# EasyEDA Pro project ProPrj_nrfSlime_2025-01-05.epro

# Schematic Schematic9
Board Name: nrfSlime v1.0; Create Date: 2024-12-22; Page Name: P1; Project Name: SlimeVR-Module; Schematic Name: Schematic9; Update Date: 2024-12-22; Company: 嘉立创EDA; Page Size: A4; Version: V1.0
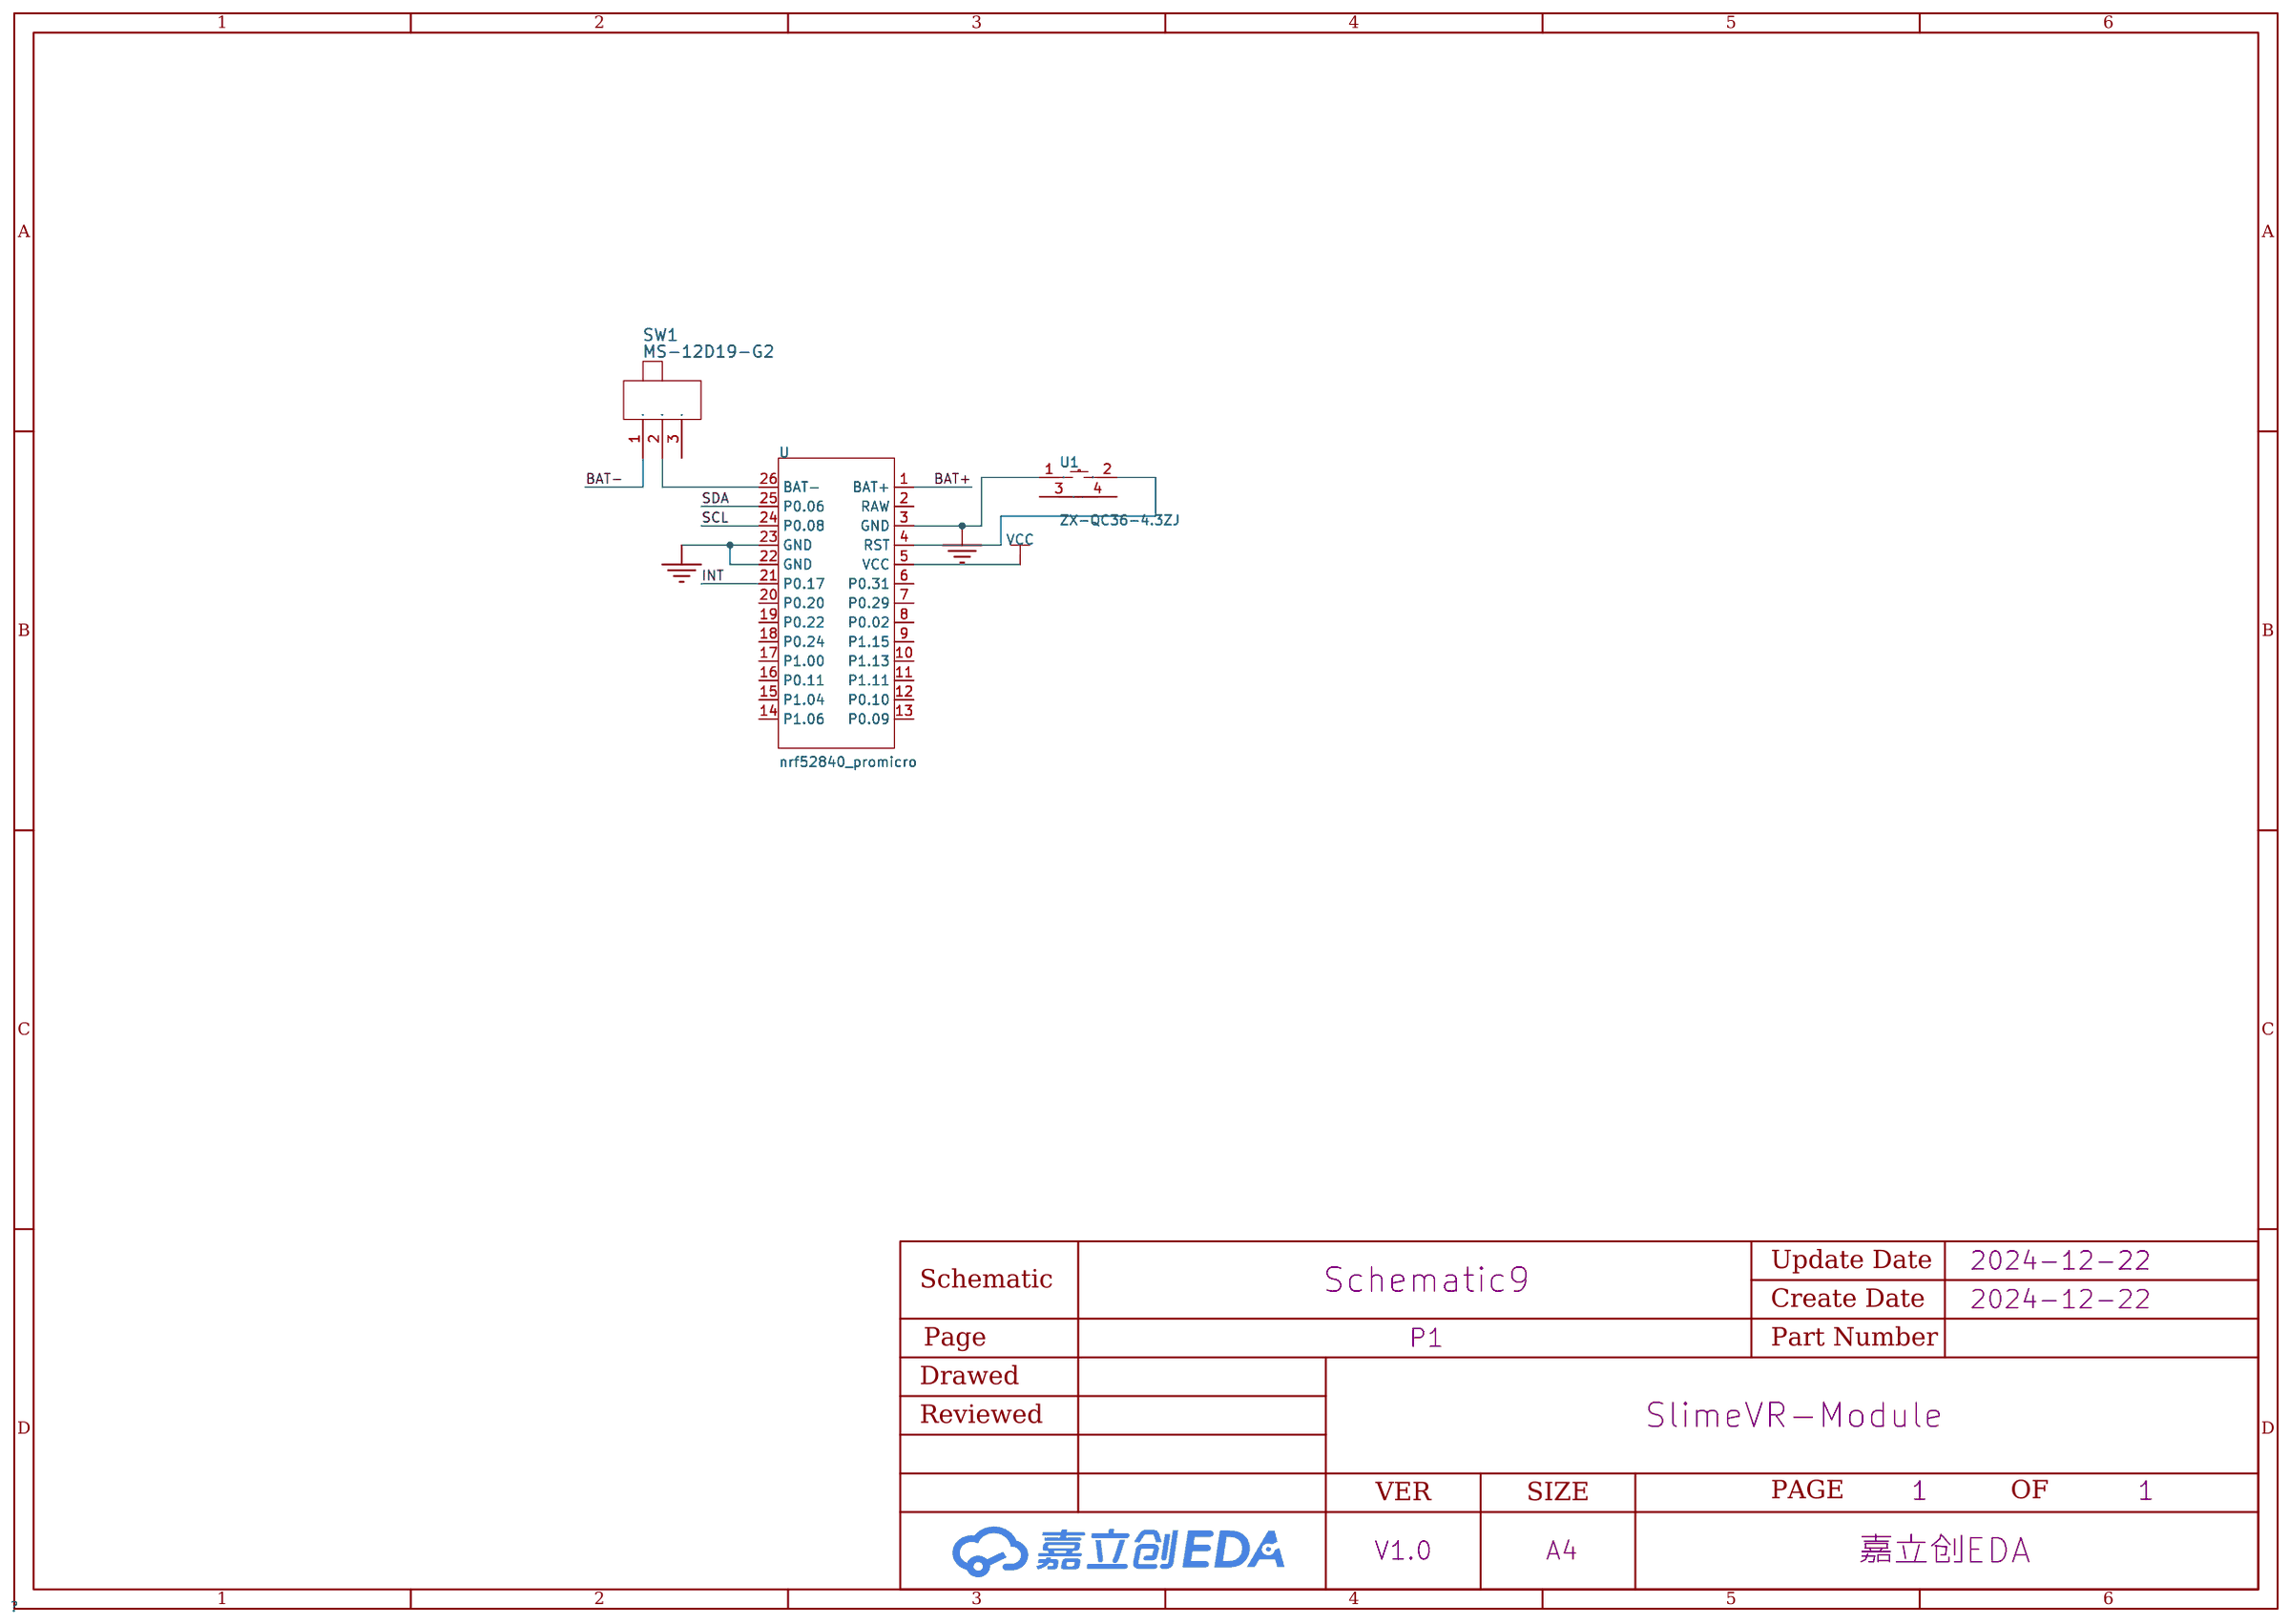
[diagram p0: schematic sheet]

## Parts
SW1  MS-12D19-G2  [12d19g开关]
U  promicro  [nrf_promicro]
U1  ZX-QC36-4.3ZJ  [SW-TH_4P-L7.5-W4.3-P5.00]

## Library data of the parts
SW1 = MS-12D19-G2: Supplier: LCSC; Supplier Part: C2904913; Manufacturer: DEALON(德艺隆)
U = nrf52840_promicro
U1 = ZX-QC36-4.3ZJ: 电路结构:单刀单掷;按钮形状:矩形按钮;作用力:260gf;安装方式:直插;开关长度:3mm;开关宽度:6mm;开关高度:4.3mm;带支架:带支架;触点电流:50mA;额定电压(AC):250V;额定电压(DC):12V;绝缘电阻:100MΩ;机械寿命:10万次;; LCSC Part Name: 3*6*4.3支架开关; Supplier Part: C7470225; Manufacturer: Megastar(兆星); Supplier Footprint: DIP; JLCPCB Part Class: Extended Part; Datasheet: https://atta.szlcsc.com/upload/public/pdf/source/20230724/E16DC04D9D1914154B8FE6FC4973841D.pdf; Supplier: LCSC; Circuit: 单刀单掷; Actuator Style: 矩形按钮; Operating Force: 260gf; Mounting Style: 直插; Switch Length: 3mm; Switch Width: 6mm; Switch Height: 4.3mm; Strike Gundam: 带支架; Contact Current: 50mA; Voltage Rating (AC): 250V; Voltage Rating (DC): 12V; Insulation Resistance: 100MΩ; Actuator/Cap Color: 白色; Pin Style: PC引脚; Mechanical Life: 10万次; Operating Temperature: -30℃~+80℃

## Nets
GND: U.3(GND) U.22(GND) U.23(GND) U1.1
VCC: U.5(VCC)
BAT+: U.1(BAT+)
BAT-: SW1.1
INT: U.21(P0.17)
SCL: U.24(P0.08)
SDA: U.25(P0.06)
$1N588: SW1.2 U.26(BAT-)
Net-(U-4): U.4(RST) U1.2

Not connected (* = marked no-connect by the designer): SW1 3; U 2(RAW) 6(P0.31) 7(P0.29) 8(P0.02) 9(P1.15) 10(P1.13) 11(P1.11) 12(P0.10) 13(P0.09) 14(P1.06) 15(P1.04) 16(P0.11) 17(P1.00) 18(P0.24) 19(P0.22) 20(P0.20); U1 3 4

# Schematic Schematic9_1
Board Name: nrfSlime v1.0; Create Date: 2024-12-22; Page Name: P1; Project Name: SlimeVR-Module; Schematic Name: Schematic9; Update Date: 2024-12-22; Company: 嘉立创EDA; Page Size: A4; Version: V1.0
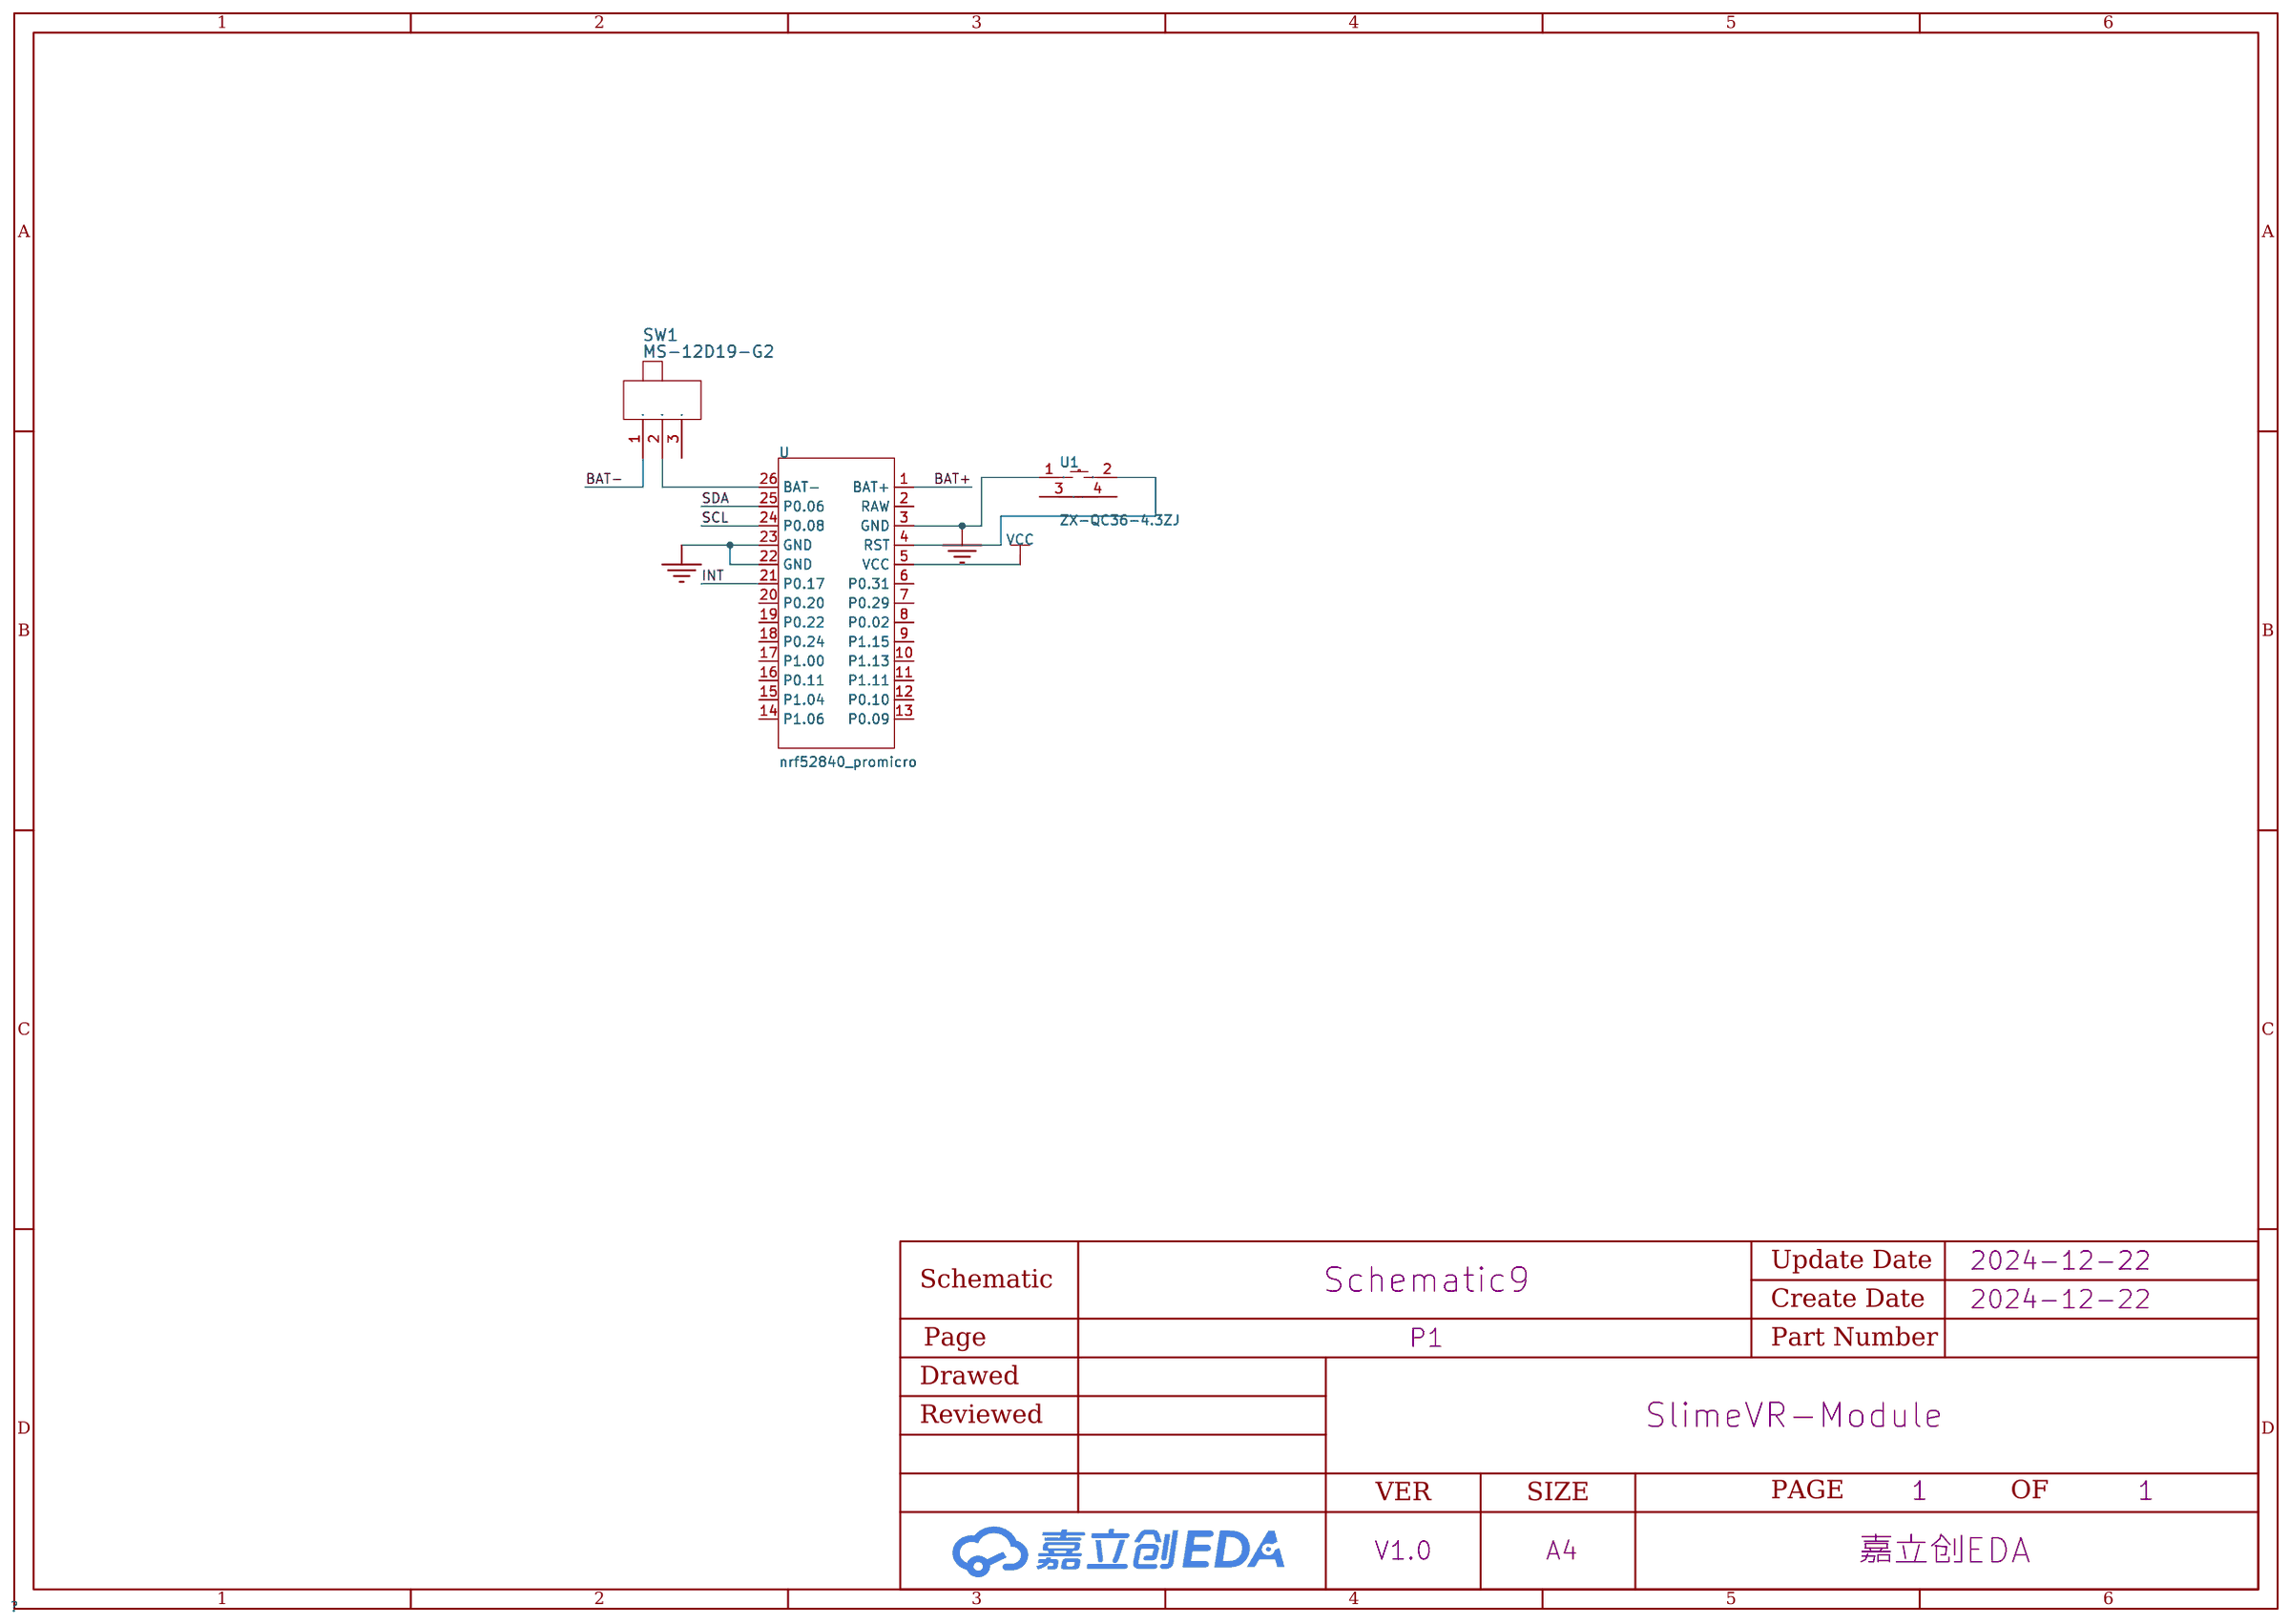
[diagram p1: schematic sheet]

## Parts
SW1  MS-12D19-G2  [12d19g开关]
U  promicro  [nrf_promicro]
U1  ZX-QC36-4.3ZJ  [SW-TH_4P-L7.5-W4.3-P5.00]

## Library data of the parts
SW1 = MS-12D19-G2: Supplier: LCSC; Supplier Part: C2904913; Manufacturer: DEALON(德艺隆)
U = nrf52840_promicro
U1 = ZX-QC36-4.3ZJ: 电路结构:单刀单掷;按钮形状:矩形按钮;作用力:260gf;安装方式:直插;开关长度:3mm;开关宽度:6mm;开关高度:4.3mm;带支架:带支架;触点电流:50mA;额定电压(AC):250V;额定电压(DC):12V;绝缘电阻:100MΩ;机械寿命:10万次;; LCSC Part Name: 3*6*4.3支架开关; Supplier Part: C7470225; Manufacturer: Megastar(兆星); Supplier Footprint: DIP; JLCPCB Part Class: Extended Part; Datasheet: https://atta.szlcsc.com/upload/public/pdf/source/20230724/E16DC04D9D1914154B8FE6FC4973841D.pdf; Supplier: LCSC; Circuit: 单刀单掷; Actuator Style: 矩形按钮; Operating Force: 260gf; Mounting Style: 直插; Switch Length: 3mm; Switch Width: 6mm; Switch Height: 4.3mm; Strike Gundam: 带支架; Contact Current: 50mA; Voltage Rating (AC): 250V; Voltage Rating (DC): 12V; Insulation Resistance: 100MΩ; Actuator/Cap Color: 白色; Pin Style: PC引脚; Mechanical Life: 10万次; Operating Temperature: -30℃~+80℃

## Nets
GND: U.3(GND) U.22(GND) U.23(GND) U1.1
VCC: U.5(VCC)
BAT+: U.1(BAT+)
BAT-: SW1.1
INT: U.21(P0.17)
SCL: U.24(P0.08)
SDA: U.25(P0.06)
$1N588: SW1.2 U.26(BAT-)
Net-(U-4): U.4(RST) U1.2

Not connected (* = marked no-connect by the designer): SW1 3; U 2(RAW) 6(P0.31) 7(P0.29) 8(P0.02) 9(P1.15) 10(P1.13) 11(P1.11) 12(P0.10) 13(P0.09) 14(P1.06) 15(P1.04) 16(P0.11) 17(P1.00) 18(P0.24) 19(P0.22) 20(P0.20); U1 3 4

# Schematic Schematic9_2
Board Name: nrfSlime v1.0; Create Date: 2024-12-22; Page Name: P1; Project Name: SlimeVR-Module; Schematic Name: Schematic9; Update Date: 2024-12-22; Company: 嘉立创EDA; Page Size: A4; Version: V1.0
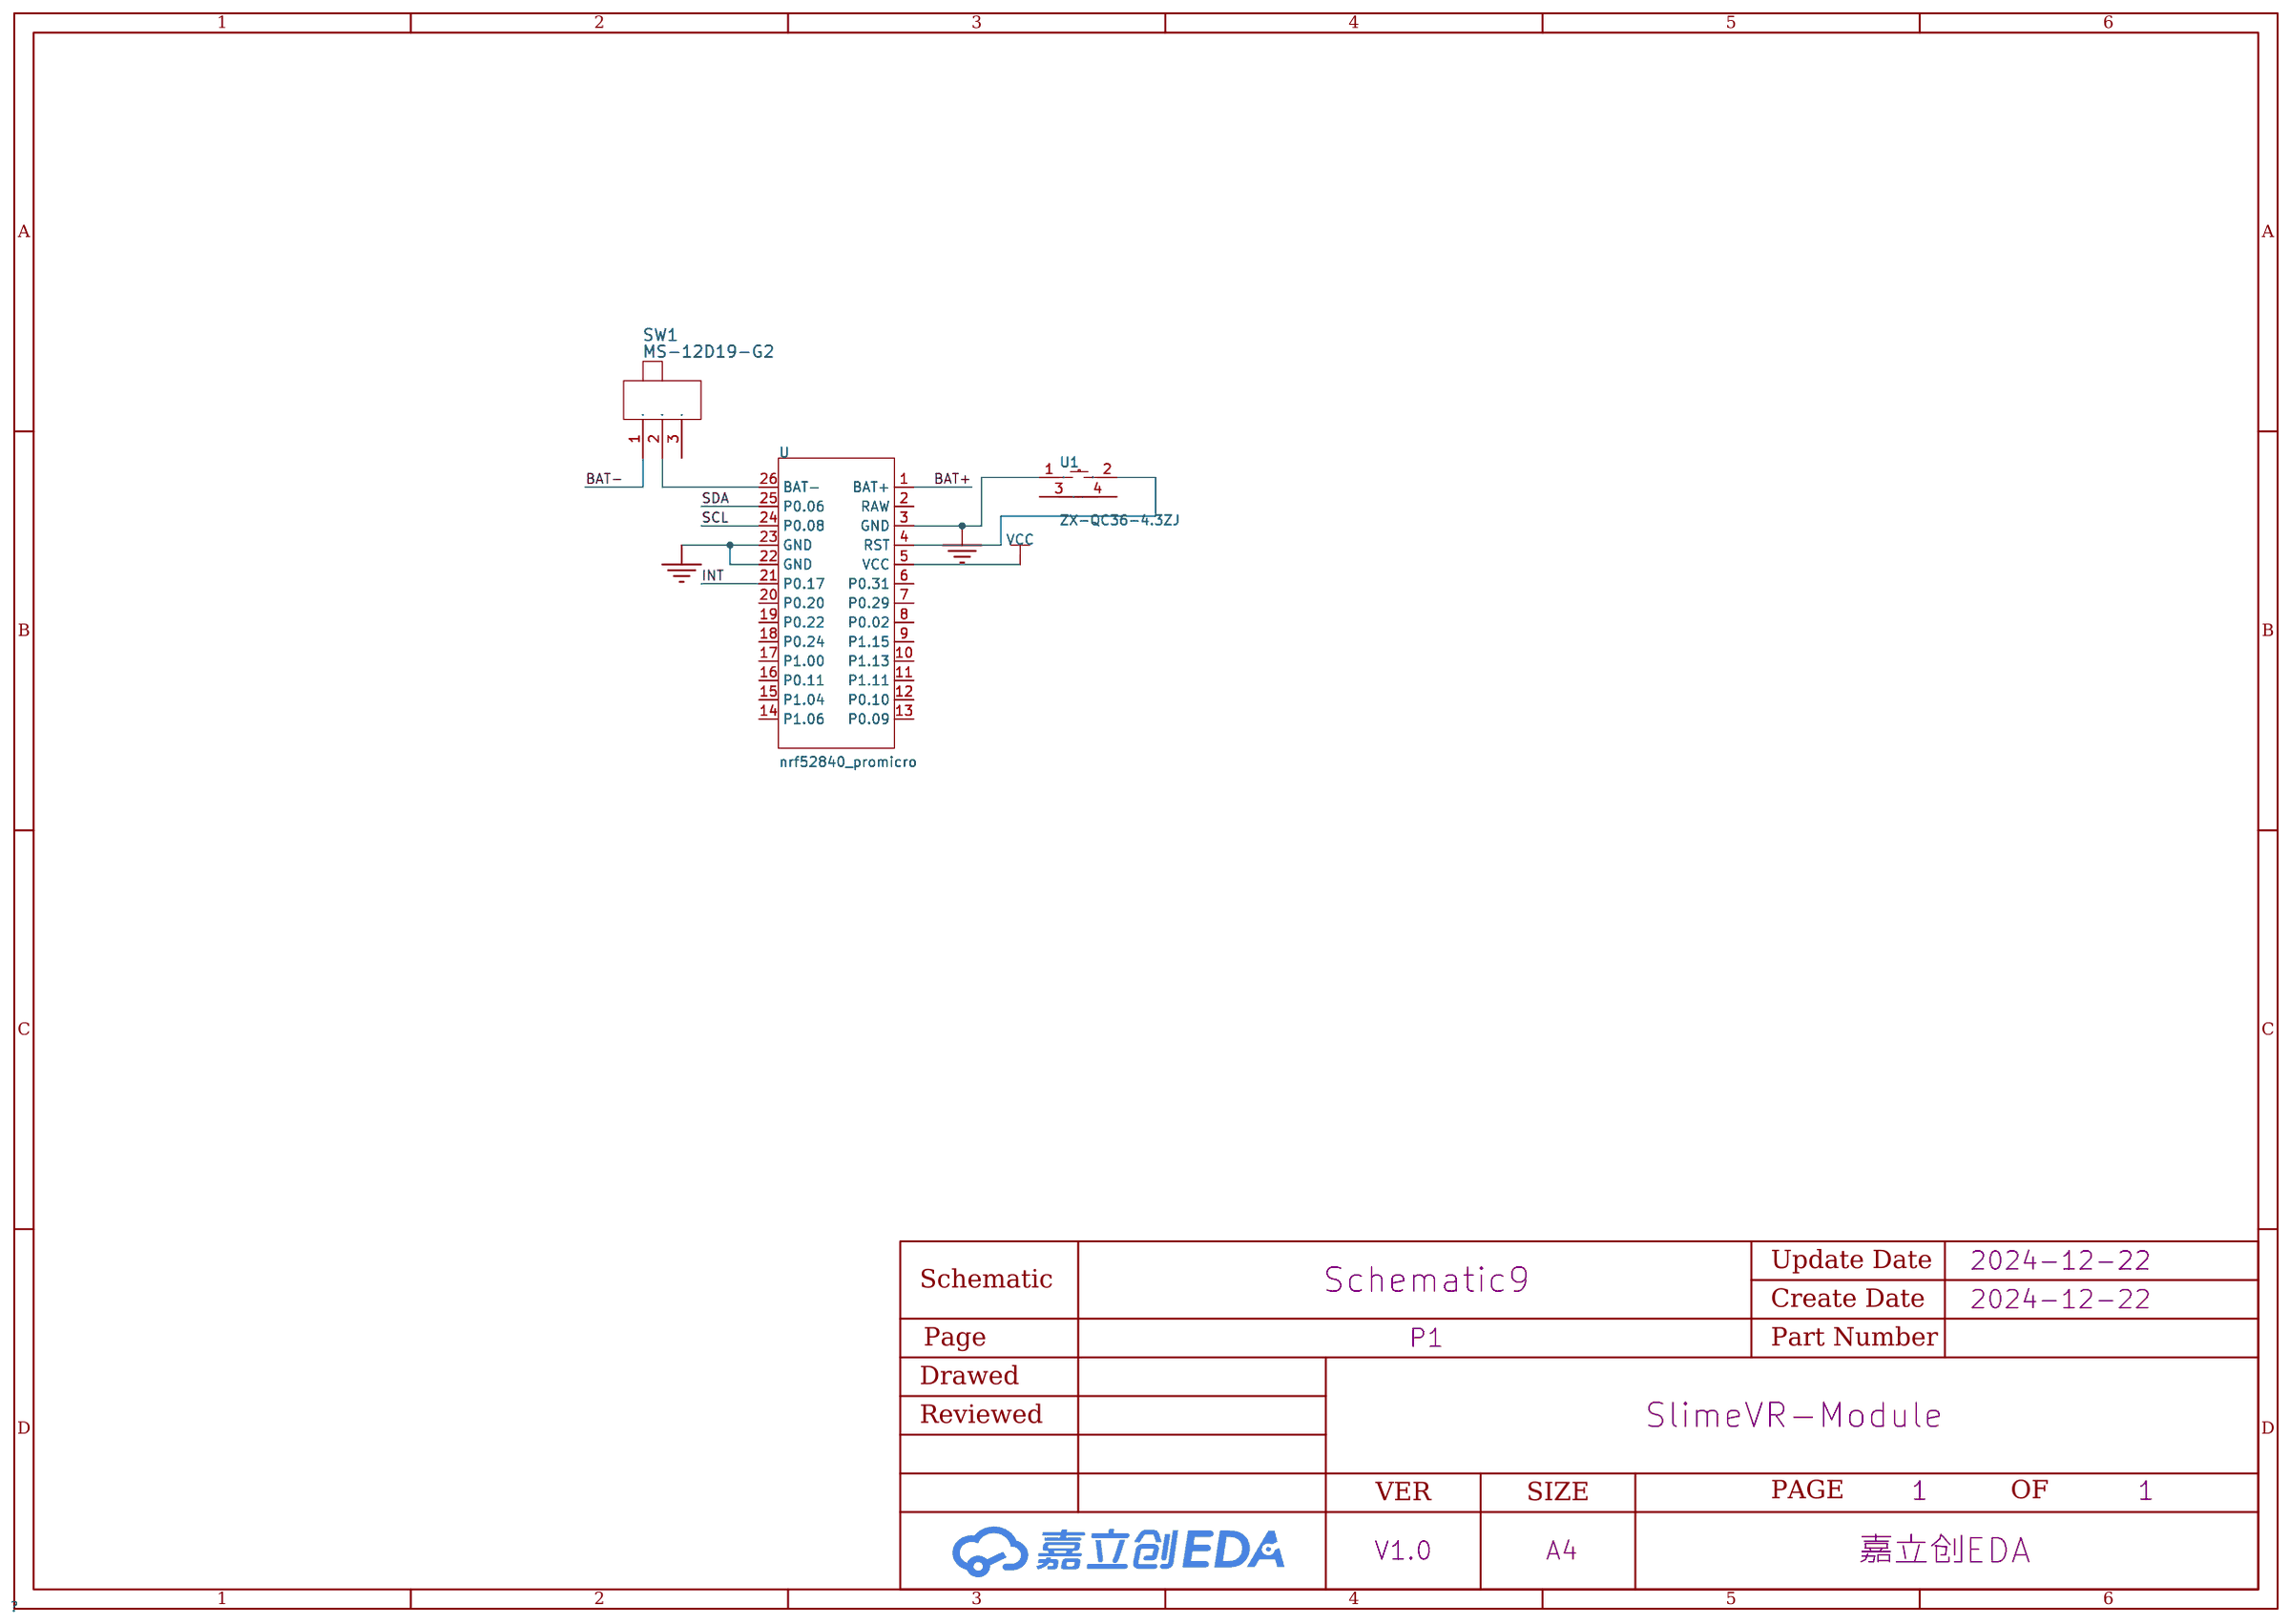
[diagram p2: schematic sheet]

## Parts
SW1  MS-12D19-G2  [12d19g开关]
U  promicro  [nrf_promicro]
U1  ZX-QC36-4.3ZJ  [SW-TH_4P-L7.5-W4.3-P5.00]

## Library data of the parts
SW1 = MS-12D19-G2: Supplier: LCSC; Supplier Part: C2904913; Manufacturer: DEALON(德艺隆)
U = nrf52840_promicro
U1 = ZX-QC36-4.3ZJ: 电路结构:单刀单掷;按钮形状:矩形按钮;作用力:260gf;安装方式:直插;开关长度:3mm;开关宽度:6mm;开关高度:4.3mm;带支架:带支架;触点电流:50mA;额定电压(AC):250V;额定电压(DC):12V;绝缘电阻:100MΩ;机械寿命:10万次;; LCSC Part Name: 3*6*4.3支架开关; Supplier Part: C7470225; Manufacturer: Megastar(兆星); Supplier Footprint: DIP; JLCPCB Part Class: Extended Part; Datasheet: https://atta.szlcsc.com/upload/public/pdf/source/20230724/E16DC04D9D1914154B8FE6FC4973841D.pdf; Supplier: LCSC; Circuit: 单刀单掷; Actuator Style: 矩形按钮; Operating Force: 260gf; Mounting Style: 直插; Switch Length: 3mm; Switch Width: 6mm; Switch Height: 4.3mm; Strike Gundam: 带支架; Contact Current: 50mA; Voltage Rating (AC): 250V; Voltage Rating (DC): 12V; Insulation Resistance: 100MΩ; Actuator/Cap Color: 白色; Pin Style: PC引脚; Mechanical Life: 10万次; Operating Temperature: -30℃~+80℃

## Nets
GND: U.3(GND) U.22(GND) U.23(GND) U1.1
VCC: U.5(VCC)
BAT+: U.1(BAT+)
BAT-: SW1.1
INT: U.21(P0.17)
SCL: U.24(P0.08)
SDA: U.25(P0.06)
$1N588: SW1.2 U.26(BAT-)
Net-(U-4): U.4(RST) U1.2

Not connected (* = marked no-connect by the designer): SW1 3; U 2(RAW) 6(P0.31) 7(P0.29) 8(P0.02) 9(P1.15) 10(P1.13) 11(P1.11) 12(P0.10) 13(P0.09) 14(P1.06) 15(P1.04) 16(P0.11) 17(P1.00) 18(P0.24) 19(P0.22) 20(P0.20); U1 3 4

# Board nrfSlime v1.1_KOUNO'S_ICM45
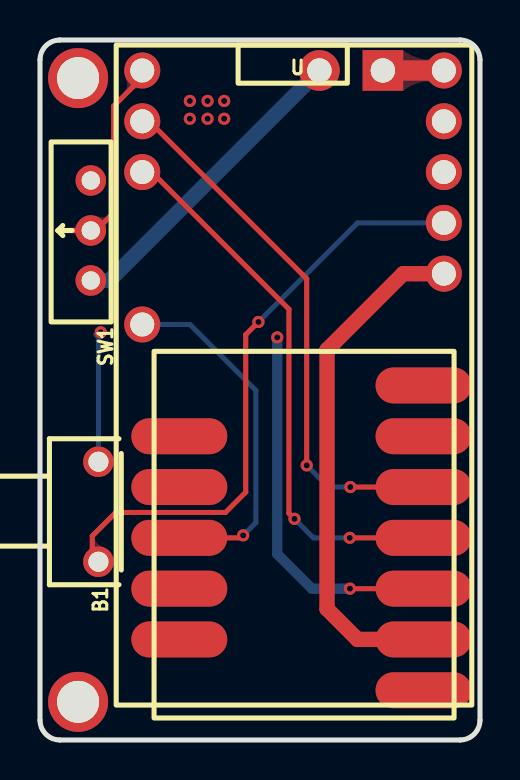
[diagram p3: board, top side]
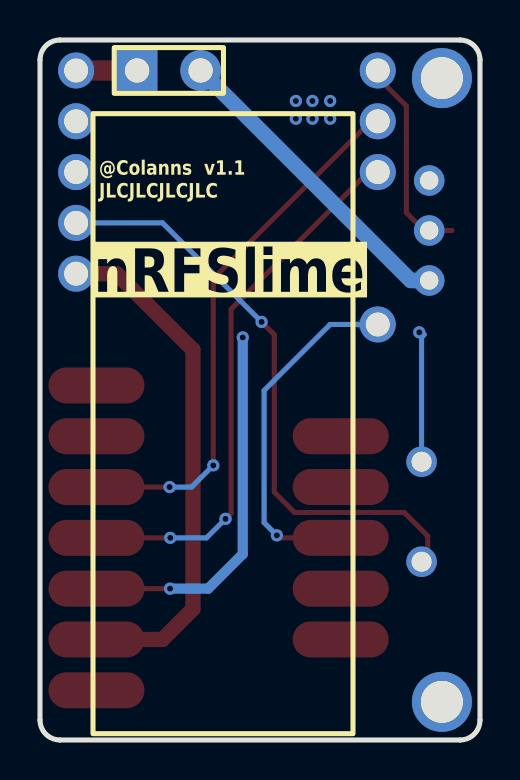
[diagram p4: board, bottom side, seen from below]

Outline 22 x 35 mm; copper layers: Top Layer, Bottom Layer. Coordinates in mm from the lower left corner of the outline.
Outline path: 0,34 0,1 arc(0.29,0.29) 1,0 21,0 arc(21.71,0.29) 22,1 22,34 arc(21.71,34.71) 21,35 1,35 arc(0.29,34.71) 0,34
Stack: Top Layer 0.035mm / Dielectric1 1.51mm FR4 er 4.5 / Bottom Layer 0.035mm

## Design rules (mm)
template: JLCPCB Capability(Two Layers Board)
spacing copperThickness1oz (default): track to track 0.102, other pairs 0.152 to 0.3
spacing copperThickness2oz: track to track 0.203, other pairs 0.152 to 0.3
track width copperThickness1oz (default): min 0.127, default 0.254, max 2.54
track width copperThickness2oz: min 0.203, default 0.254, max 2.54
differential pair differentialPair (default): width min 0.127, default 0.254, max 2.54; gap min 0.152, default 0.152
via viaSize (default): diameter min 0.5, default 0.61, max 10; hole min 0.3, default 0.305, max 6.3

## Placement (name value [footprint] x y rotation side)
B1  ZX-QC36-4.3ZJ  [SW-TH_4P-L7.5-W4.3-P5.00]  4.17 11.41 90 top
NOREF  -  [Pad_e6]  13.97 33.48 0 top
NOREF#2  -  [Pad_e794]  1.91 1.91 0 top
NOREF#3  -  [Pad_e11]  1.91 33.09 0 top
NOREF#4  -  [Pad_e5]  17.15 33.48 0 top
SW1  MS-12D19-G2  [12d19g开关]  3.56 20.9 90 top
U  promicro  [nrf_promicro]  12.57 18.11 0 top
U6  -  [BNO080九轴陀螺仪模块]  12.95 13.92 180 top

## Footprints (pads in the part's own frame, mm; a bottom-side part is the same pattern mirrored in y, then rotated)
12d19g开关
  round 1.524 hole 0.914: 1(2.072,1.016) 2(4.572,1.016) 3(7.072,1.016)
BNO080九轴陀螺仪模块
  oval 4.8x1.8 smd: 1(-6.223,11.43) 2(-6.223,8.89) 3(-6.223,6.35) 4(-6.223,3.81) 5(-6.223,1.27) 6(-6.223,-1.27) 7(-6.223,-3.81) 8(5.989,8.89) 9(5.989,6.35) 10(5.989,3.81) 11(5.989,1.27) 12(5.989,-1.27)
nrf_promicro
  round 1.8 hole 1.2: 1(7.62,15.367) 2(7.62,12.827) 3(7.62,10.287) 4(7.62,7.747) 5(7.62,5.207) 21(-7.461,2.667) 24(-7.461,10.287) 25(-7.461,12.827) 26(-7.461,15.367)
Pad_e5
  rect 2.032x2.032 hole 1.219: 1(0,0)
Pad_e6
  round 2.032 hole 1.219: 2(0,0)
Pad_e11
  round 3 hole 2.1: 1(0,0)
Pad_e794
  round 3 hole 2.1: 1(0,0)
SW-TH_4P-L7.5-W4.3-P5.00
  round 1.524 hole 1: 1(-2.5,1.25) 2(2.5,1.25)

## Nets
GND: B1.2 NOREF#3.1 U.3 U6.3
VCC: U.5 U6.2
BAT+: NOREF#4.1 U.1
BAT-: NOREF.2 SW1.1
INT: U.21 U6.10
SCL: U.24 U6.4
SDA: U.25 U6.5
$1N588: SW1.2 U.26
$1N821: B1.1 U.4

Pads without a net: NOREF#2 1; SW1 3; U 2; U6 1 6 7 8 9 11 12

## Via types
v1: diameter 0.61, hole 0.305, Top Layer to Bottom Layer, 15 vias

## Routing (per net, layer and track width the routed paths; a pad name or vN(x,y) marks a point on that pad's centre or on a via; arc(x,y) is an arc through that point)
GND: length 25.6
  Top Layer w0.254: v1(15.5,7.57) U6.3
  Bottom Layer w0.254: B1.2 2.92,20.14 2.79,20.27 2.92,20.27 v1(3.04,20.38)
  Bottom Layer w0.508: v1(15.5,7.57) 13.59,7.57 11.86,9.3 v1(11.86,20.13)
  vias: v1(7.49,31.95) v1(7.49,31.06) v1(8.38,31.95) v1(8.38,31.06) v1(9.21,31.95) v1(9.21,31.06)
VCC: length 25.9
  Top Layer w0.762: 19.24,5.03 15.88,5.03 14.35,6.55 14.35,19.51 18.16,23.32 U.5
BAT+: length 3
  Top Layer w1.016: NOREF#4.1 U.1
BAT-: length 15.8
  Bottom Layer w0.762: NOREF.2 3.47,22.97 SW1.1
INT: length 17.8
  Top Layer w0.254: v1(10.16,10.23) 10.03,10.11 U6.10
  Bottom Layer w0.254: v1(10.16,10.23) 10.8,10.87 10.8,17.47 7.49,20.78 U.21
SCL: length 27.6
  Top Layer w0.254: U.24 5.59,28.4 12.45,21.54 12.45,11.34 v1(12.73,11.06) ; v1(15.49,10.11) U6.4
  Bottom Layer w0.254: v1(15.49,10.11) 13.67,10.11 v1(12.73,11.06)
SDA: length 27.1
  Top Layer w0.254: v1(13.34,13.73) 13.34,23.06 5.46,30.94 U.25 ; v1(15.52,12.65) U6.5
  Bottom Layer w0.254: v1(13.34,13.73) 14.42,12.65 v1(15.52,12.65)
$1N588: length 10.4
  Top Layer w0.254: U.26 5.11,33.13 3.68,31.7 3.68,26.36 2.79,25.47 1.4,25.47
$1N821: length 30
  Top Layer w0.254: 2.61,8.86 2.61,10.2 3.79,11.38 9.27,11.38 10.29,12.39 10.29,20.27 v1(10.92,20.9)
  Bottom Layer w0.254: U.4 15.88,25.86 v1(10.92,20.9)

## Copper pours and planes (outline as drawn; the poured copper is in the pictures)
GND on Top Layer: -9.08,46.56 25.84,46.56 25.84,19.63 -9.08,19.63
GND on Bottom Layer: -2.98,46.56 31.94,46.56 31.94,19.63 -2.98,19.63

Small or netless copper shapes (teardrops, artwork), in the pictures only: 6 on Top Layer, 3 on Bottom Layer

## Text on the board
Bottom Silkscreen Layer: @Colanns  v1.1 | JLCJLCJLCJLC | nRFSlime

# Board nrfSlime_v1.1_VGLAXXI
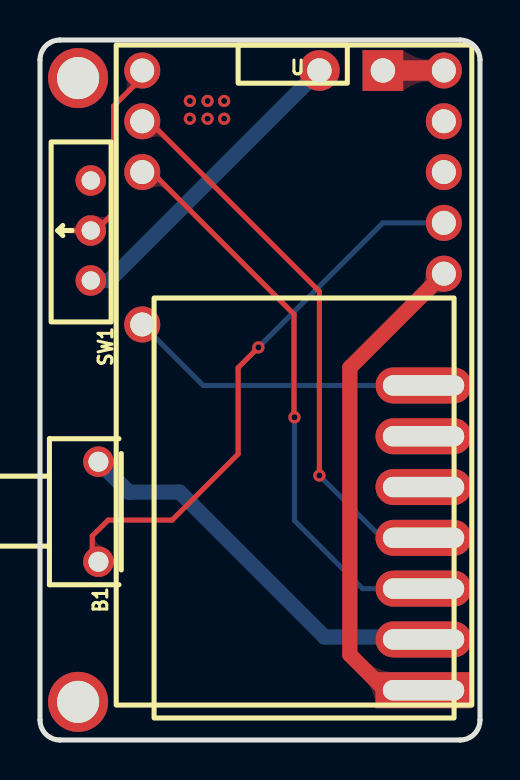
[diagram p5: board, top side]
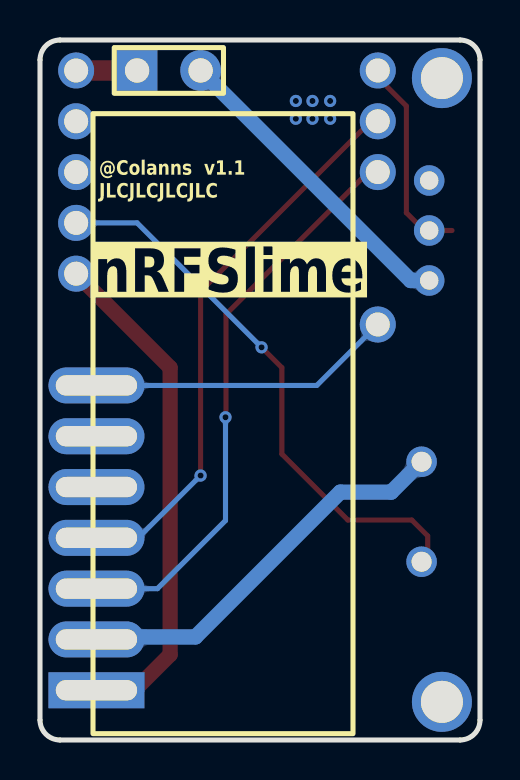
[diagram p6: board, bottom side, seen from below]

Outline 22 x 35 mm; copper layers: Top Layer, Bottom Layer. Coordinates in mm from the lower left corner of the outline.
Outline path: 0,34 0,1 arc(0.29,0.29) 1,0 21,0 arc(21.71,0.29) 22,1 22,34 arc(21.71,34.71) 21,35 1,35 arc(0.29,34.71) 0,34
Stack: Top Layer 0.035mm / Dielectric1 1.51mm FR4 er 4.5 / Bottom Layer 0.035mm

## Design rules (mm)
template: JLCPCB Capability(Two Layers Board)
spacing copperThickness1oz (default): track to track 0.102, other pairs 0.152 to 0.3
spacing copperThickness2oz: track to track 0.203, other pairs 0.152 to 0.3
track width copperThickness1oz (default): min 0.127, default 0.254, max 2.54
track width copperThickness2oz: min 0.203, default 0.254, max 2.54
differential pair differentialPair (default): width min 0.127, default 0.254, max 2.54; gap min 0.152, default 0.152
via viaSize (default): diameter min 0.5, default 0.61, max 10; hole min 0.3, default 0.305, max 6.3

## Placement (name value [footprint] x y rotation side)
B1  ZX-QC36-4.3ZJ  [SW-TH_4P-L7.5-W4.3-P5.00]  4.17 11.41 90 top
NOREF  -  [Pad_e11]  1.91 33.09 0 top
NOREF#2  -  [Pad_e6]  13.97 33.48 0 top
NOREF#3  -  [Pad_e794]  1.91 1.91 0 top
NOREF#4  -  [Pad_e5]  17.15 33.48 0 top
SW1  MS-12D19-G2  [12d19g开关]  3.56 20.9 90 top
U  promicro  [nrf_promicro]  12.57 18.11 0 top
U6  -  [BNO080九轴陀螺仪模块]  12.95 13.92 180 top

## Footprints (pads in the part's own frame, mm; a bottom-side part is the same pattern mirrored in y, then rotated)
12d19g开关
  round 1.524 hole 0.914: 1(2.072,1.016) 2(4.572,1.016) 3(7.072,1.016)
BNO080九轴陀螺仪模块
  rect 4.8x1.8 hole 4.064x1.016: 1(-6.223,11.43)
  oval 4.8x1.8 hole 4.064x1.016: 2(-6.223,8.89) 3(-6.223,6.35) 4(-6.223,3.81) 5(-6.223,1.27) 6(-6.223,-1.27) 7(-6.223,-3.81)
nrf_promicro
  round 1.8 hole 1.2: 1(7.62,15.367) 2(7.62,12.827) 3(7.62,10.287) 4(7.62,7.747) 5(7.62,5.207) 21(-7.461,2.667) 24(-7.461,10.287) 25(-7.461,12.827) 26(-7.461,15.367)
Pad_e5
  rect 2.032x2.032 hole 1.219: 1(0,0)
Pad_e6
  round 2.032 hole 1.219: 2(0,0)
Pad_e11
  round 3 hole 2.1: 1(0,0)
Pad_e794
  round 3 hole 2.1: 1(0,0)
SW-TH_4P-L7.5-W4.3-P5.00
  round 1.524 hole 1: 1(-2.5,1.25) 2(2.5,1.25)

## Nets
GND: B1.2 NOREF.1 U.3 U6.2
VCC: U.5 U6.1
BAT+: NOREF#4.1 U.1
BAT-: NOREF#2.2 SW1.1
INT: U.21 U6.7
SCL: U.24 U6.3
SDA: U.25 U6.4
$1N588: SW1.2 U.26
$1N821: B1.1 U.4

Pads without a net: NOREF#3 1; SW1 3; U 2; U6 5 6

## Via types
v1: diameter 0.61, hole 0.305, Top Layer to Bottom Layer, 9 vias

## Routing (per net, layer and track width the routed paths; a pad name or vN(x,y) marks a point on that pad's centre or on a via; arc(x,y) is an arc through that point)
GND: length 19.9
  Bottom Layer w0.762: U6.2 19.05,5.16 14.22,5.16 6.99,12.39 4.44,12.39 B1.2
  vias: v1(7.49,31.95) v1(7.49,31.06) v1(8.38,31.95) v1(8.38,31.06) v1(9.21,31.95) v1(9.21,31.06)
VCC: length 26.3
  Top Layer w0.762: U.5 15.49,18.62 15.49,4.27 17.27,2.49 U6.1 20.07,2.49
BAT+: length 3
  Top Layer w1.016: NOREF#4.1 U.1
BAT-: length 15.8
  Bottom Layer w0.762: SW1.1 3.47,22.97 NOREF#2.2
INT: length 16.2
  Bottom Layer w0.254: 20.07,17.73 8.16,17.73 U.21
SCL: length 28.7
  Top Layer w0.254: U.24 5.59,28.4 12.7,21.28 12.7,16.16 v1(12.73,16.14)
  Bottom Layer w0.254: U6.3 16.13,7.57 12.73,10.97 v1(12.73,16.14)
SDA: length 28.1
  Top Layer w0.254: v1(13.97,13.22) 13.97,22.43 5.46,30.94 U.25
  Bottom Layer w0.254: v1(13.97,13.22) 17.09,10.11 U6.4
$1N588: length 10.4
  Top Layer w0.254: U.26 5.11,33.13 3.68,31.7 3.68,26.36 2.79,25.47 1.4,25.47
$1N821: length 27.9
  Top Layer w0.254: v1(10.92,19.63) 9.91,18.62 9.91,14.3 6.6,11 3.41,11 2.61,10.2 2.61,8.86
  Bottom Layer w0.254: U.4 17.15,25.86 v1(10.92,19.63)

## Copper pours and planes (outline as drawn; the poured copper is in the pictures)
GND on Top Layer: -10.86,38.3 24.07,38.3 24.07,11.38 -10.86,11.38
GND on Bottom Layer: -3.49,38.3 31.43,38.3 31.43,11.38 -3.49,11.38

Small or netless copper shapes (teardrops, artwork), in the pictures only: 13 on Top Layer, 12 on Bottom Layer

## Text on the board
Bottom Silkscreen Layer: @Colanns  v1.1 | JLCJLCJLCJLC | nRFSlime

# Board nrfSlime v1.1_VGGALXI_1
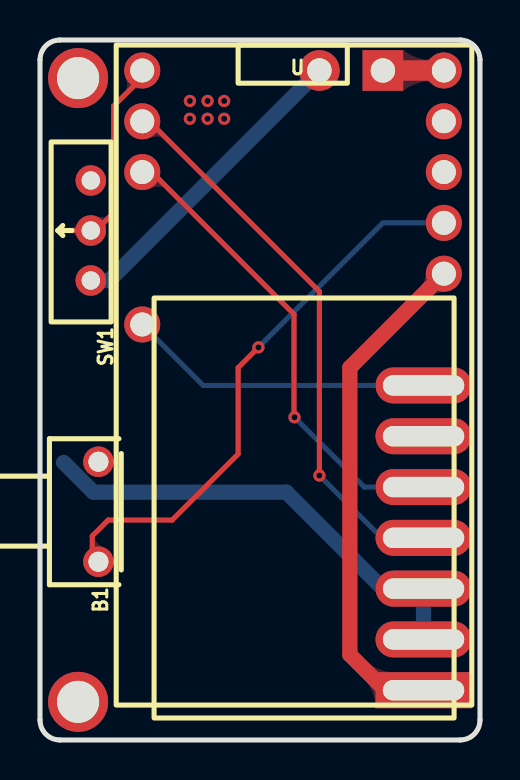
[diagram p7: board, top side]
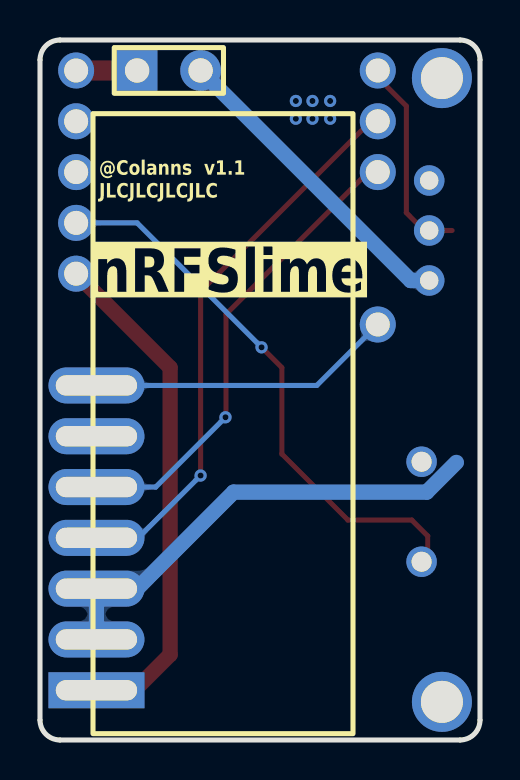
[diagram p8: board, bottom side, seen from below]

Outline 22 x 35 mm; copper layers: Top Layer, Bottom Layer. Coordinates in mm from the lower left corner of the outline.
Outline path: 0,34 0,1 arc(0.29,0.29) 1,0 21,0 arc(21.71,0.29) 22,1 22,34 arc(21.71,34.71) 21,35 1,35 arc(0.29,34.71) 0,34
Stack: Top Layer 0.035mm / Dielectric1 1.51mm FR4 er 4.5 / Bottom Layer 0.035mm

## Design rules (mm)
template: JLCPCB Capability(Two Layers Board)
spacing copperThickness1oz (default): track to track 0.102, other pairs 0.152 to 0.3
spacing copperThickness2oz: track to track 0.203, other pairs 0.152 to 0.3
track width copperThickness1oz (default): min 0.127, default 0.254, max 2.54
track width copperThickness2oz: min 0.203, default 0.254, max 2.54
differential pair differentialPair (default): width min 0.127, default 0.254, max 2.54; gap min 0.152, default 0.152
via viaSize (default): diameter min 0.5, default 0.61, max 10; hole min 0.3, default 0.305, max 6.3

## Placement (name value [footprint] x y rotation side)
B1  ZX-QC36-4.3ZJ  [SW-TH_4P-L7.5-W4.3-P5.00]  4.17 11.41 90 top
NOREF  -  [Pad_e5]  17.15 33.48 0 top
NOREF#2  -  [Pad_e11]  1.91 33.09 0 top
NOREF#3  -  [Pad_e6]  13.97 33.48 0 top
NOREF#4  -  [Pad_e794]  1.91 1.91 0 top
SW1  MS-12D19-G2  [12d19g开关]  3.56 20.9 90 top
U  promicro  [nrf_promicro]  12.57 18.11 0 top
U6  -  [BNO080九轴陀螺仪模块]  12.95 13.92 180 top

## Footprints (pads in the part's own frame, mm; a bottom-side part is the same pattern mirrored in y, then rotated)
12d19g开关
  round 1.524 hole 0.914: 1(2.072,1.016) 2(4.572,1.016) 3(7.072,1.016)
BNO080九轴陀螺仪模块
  rect 4.8x1.8 hole 4.064x1.016: 1(-6.223,11.43)
  oval 4.8x1.8 hole 4.064x1.016: 2(-6.223,8.89) 3(-6.223,6.35) 4(-6.223,3.81) 5(-6.223,1.27) 6(-6.223,-1.27) 7(-6.223,-3.81)
nrf_promicro
  round 1.8 hole 1.2: 1(7.62,15.367) 2(7.62,12.827) 3(7.62,10.287) 4(7.62,7.747) 5(7.62,5.207) 21(-7.461,2.667) 24(-7.461,10.287) 25(-7.461,12.827) 26(-7.461,15.367)
Pad_e5
  rect 2.032x2.032 hole 1.219: 1(0,0)
Pad_e6
  round 2.032 hole 1.219: 2(0,0)
Pad_e11
  round 3 hole 2.1: 1(0,0)
Pad_e794
  round 3 hole 2.1: 1(0,0)
SW-TH_4P-L7.5-W4.3-P5.00
  round 1.524 hole 1: 1(-2.5,1.25) 2(2.5,1.25)

## Nets
GND: B1.2 NOREF#2.1 U.3 U6.2 U6.3
VCC: U.5 U6.1
BAT+: NOREF.1 U.1
BAT-: NOREF#3.2 SW1.1
INT: U.21 U6.7
SCL: U.24 U6.5
SDA: U.25 U6.4
$1N588: SW1.2 U.26
$1N821: B1.1 U.4

Pads without a net: NOREF#4 1; SW1 3; U 2; U6 6

## Via types
v1: diameter 0.61, hole 0.305, Top Layer to Bottom Layer, 9 vias

## Routing (per net, layer and track width the routed paths; a pad name or vN(x,y) marks a point on that pad's centre or on a via; arc(x,y) is an arc through that point)
GND: length 23.1
  Bottom Layer w0.762: 1.18,13.88 2.67,12.39 12.32,12.39 17.15,7.57 U6.3 U6.2
  vias: v1(7.49,31.95) v1(7.49,31.06) v1(8.38,31.95) v1(8.38,31.06) v1(9.21,31.95) v1(9.21,31.06)
VCC: length 26.3
  Top Layer w0.762: U.5 15.49,18.62 15.49,4.27 17.27,2.49 U6.1 20.07,2.49
BAT+: length 3
  Top Layer w1.016: NOREF.1 U.1
BAT-: length 15.8
  Bottom Layer w0.762: NOREF#3.2 3.47,22.97 SW1.1
INT: length 16.2
  Bottom Layer w0.254: 20.07,17.73 8.16,17.73 U.21
SCL: length 23.6
  Top Layer w0.254: U.24 5.59,28.4 12.7,21.28 12.7,16.16 v1(12.73,16.14)
  Bottom Layer w0.254: v1(12.73,16.14) 16.21,12.65 U6.5
SDA: length 28.1
  Top Layer w0.254: U.25 5.46,30.94 13.97,22.43 v1(13.97,13.22)
  Bottom Layer w0.254: v1(13.97,13.22) 17.09,10.11 U6.4
$1N588: length 10.4
  Top Layer w0.254: 1.4,25.47 2.79,25.47 3.68,26.36 3.68,31.7 5.11,33.13 U.26
$1N821: length 27.9
  Top Layer w0.254: v1(10.92,19.63) 9.91,18.62 9.91,14.3 6.6,11 3.41,11 2.61,10.2 2.61,8.86
  Bottom Layer w0.254: v1(10.92,19.63) 17.15,25.86 U.4

## Copper pours and planes (outline as drawn; the poured copper is in the pictures)
GND on Top Layer: -10.86,38.3 24.07,38.3 24.07,11.38 -10.86,11.38
GND on Bottom Layer: -3.49,38.3 31.43,38.3 31.43,11.38 -3.49,11.38

Small or netless copper shapes (teardrops, artwork), in the pictures only: 13 on Top Layer, 13 on Bottom Layer

## Text on the board
Bottom Silkscreen Layer: @Colanns  v1.1 | JLCJLCJLCJLC | nRFSlime
